# EAGLE design halo_244 (EAGLE 8.0.2)
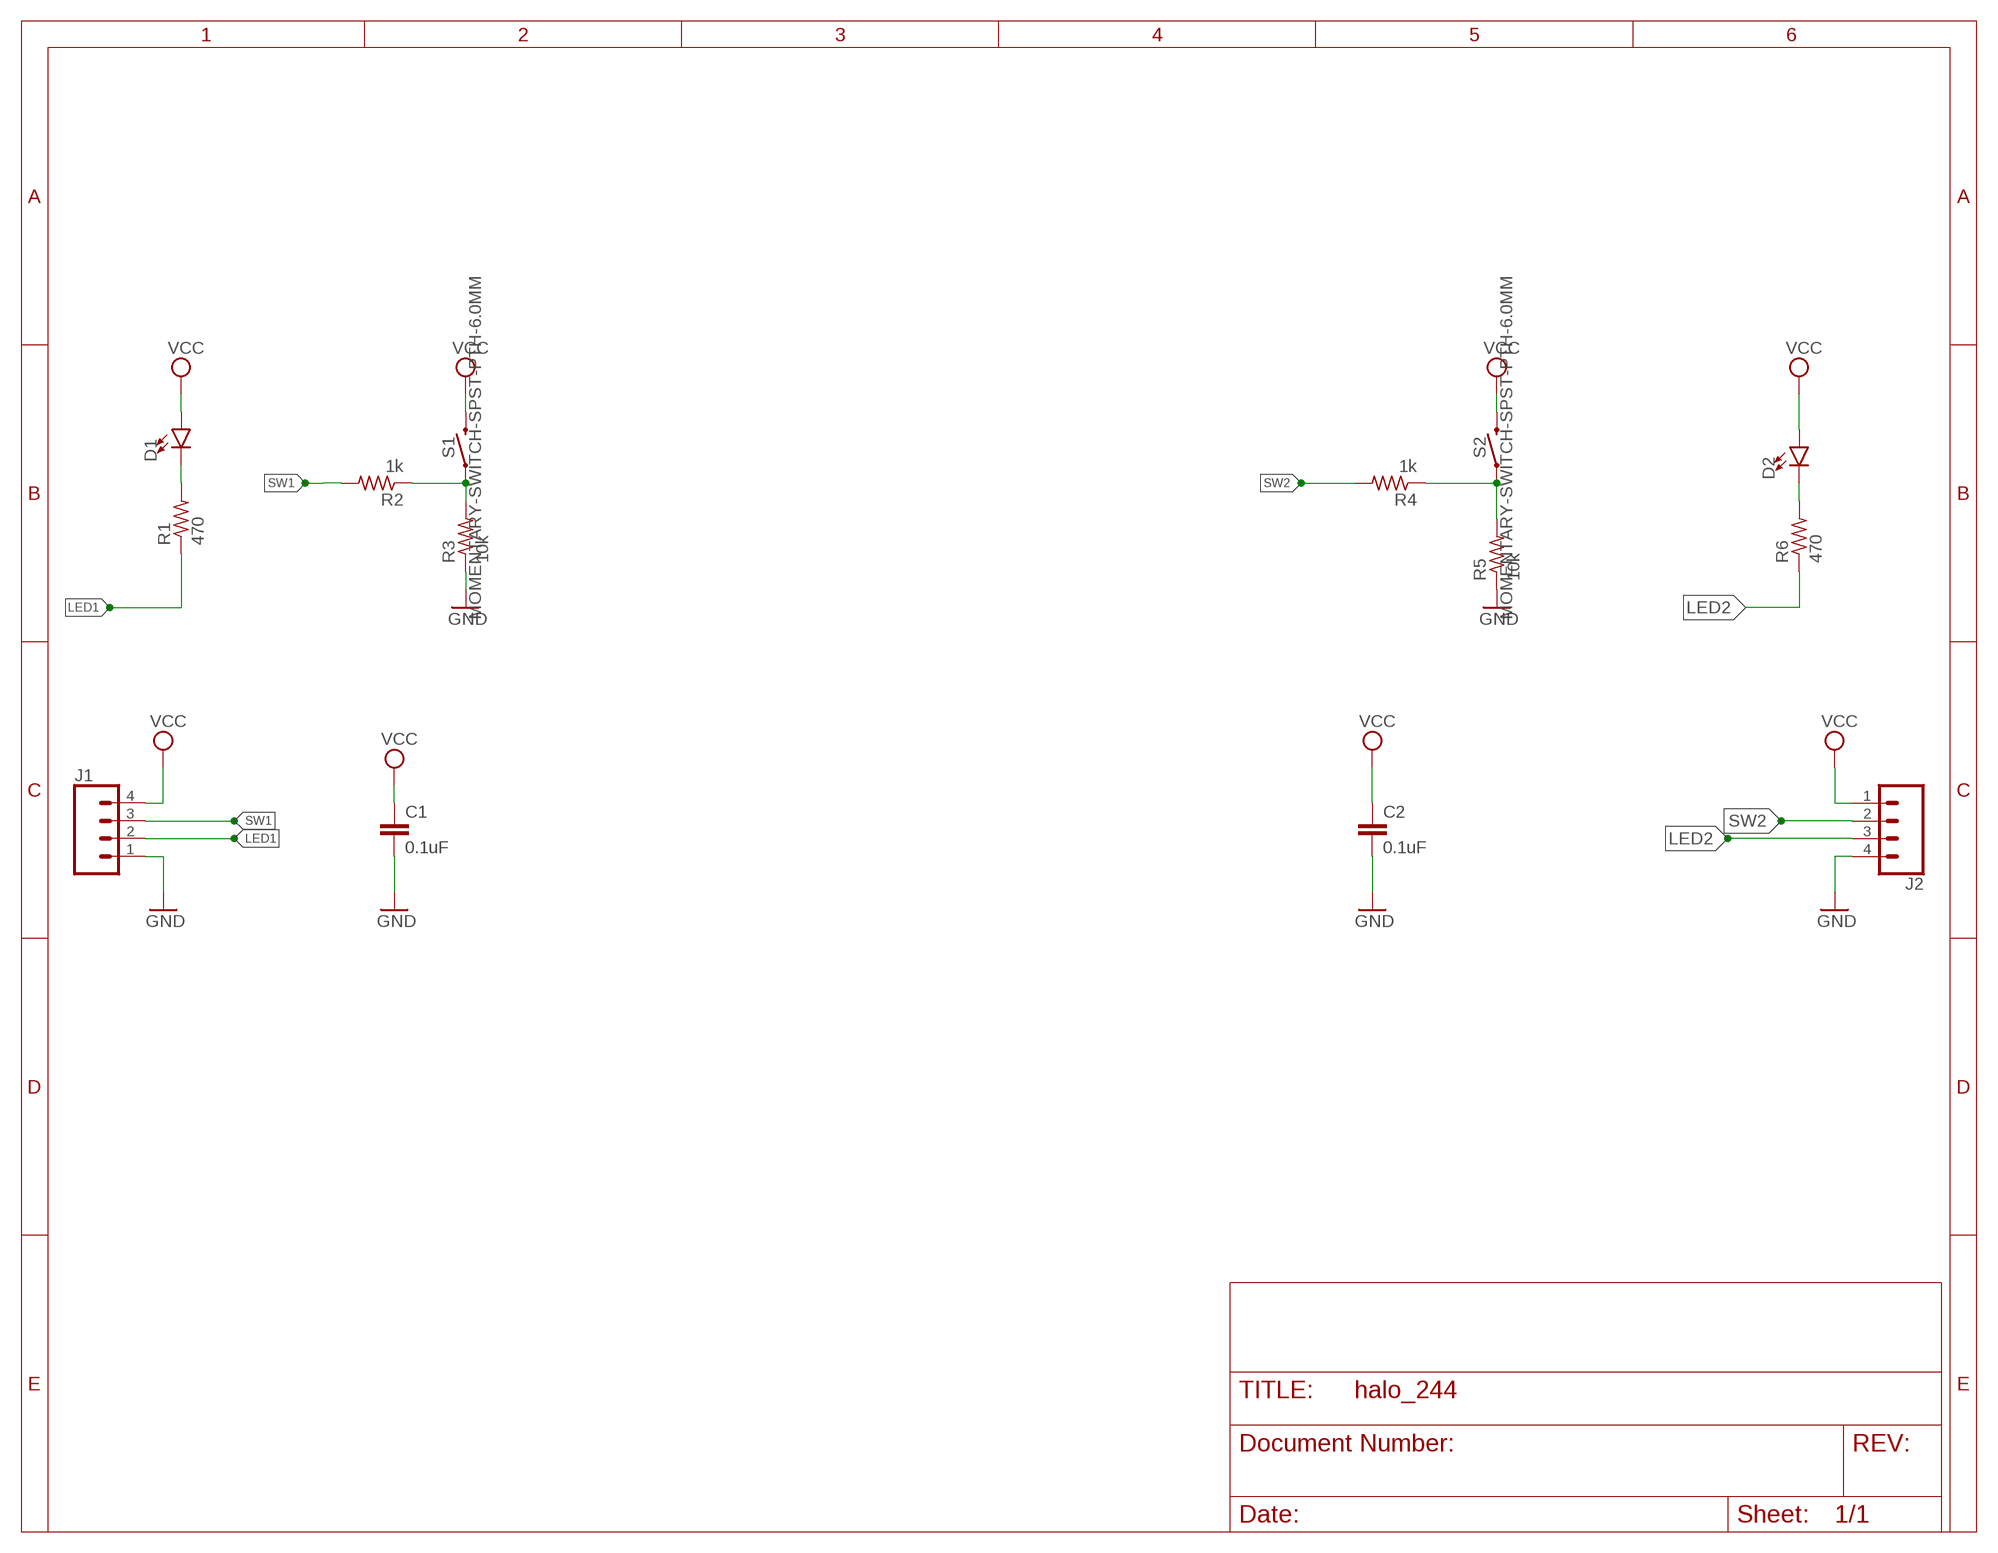
[diagram p0: schematic, sheet 1]

## Parts
C1  0.1uF  0.1UF-KIT-EZ-50V-20%  [CAP-PTH-SMALL-KIT]
C2  0.1uF  0.1UF-KIT-EZ-50V-20%  [CAP-PTH-SMALL-KIT]
D1  LED-3MM-NO_SILK  [LED_3MM-NS]
D2  LED-3MM-NO_SILK  [LED_3MM-NS]
J1  CONN_04  [1X04]
J2  CONN_04  [1X04]
R1  470  R-US_0207/12  [0207/12]
R2  1k  R-US_0207/12  [0207/12]
R3  10k  R-US_0207/12  [0207/12]
R4  1k  R-US_0207/12  [0207/12]
R5  10k  R-US_0207/12  [0207/12]
R6  470  R-US_0207/12  [0207/12]
S1  MOMENTARY-SWITCH-SPST-PTH-6.0MM  [TACTILE_SWITCH_PTH_6.0MM]
S2  MOMENTARY-SWITCH-SPST-PTH-6.0MM  [TACTILE_SWITCH_PTH_6.0MM]

## Nets
GND: C1.2 C2.2 J1.1 J2.4 R3.1 R5.1
LED1: J1.2 R1.1
LED2: J2.3 R6.1
N$1: R2.1 R3.2 S1.1
N$2: D1.K(C) R1.2
N$3: D2.K(C) R6.2
N$4: R4.1 R5.2 S2.1
SW1: J1.3 R2.2
SW2: J2.2 R4.2
VCC: C1.1 C2.1 D1.A D2.A J1.4 J2.1 S1.3 S2.3

## Library data of the parts
C1 C2 = SparkFun-Capacitors:0.1UF: 0.1µF ceramic capacitors A capacitor is a passive two-terminal electrical component used to store electrical energy temporarily in an electric field.; PROD_ID: CAP-08370
D1 D2 = SparkFun-LED:LED: LED (Generic) Standard schematic elements and footprints for 5mm, 3mm, 1206, and 0603 sized LEDs. Generic LEDs with no color specified.
J1 J2 = SparkFun-Connectors:CONN_04: Multi connection point. Often used as Generic Header-pin footprint for 0.1 inch spaced/style header connections On any of the 0.1 inch spaced packages, you can populate with these: Break Away Headers - Straight <https://www.sparkfun.com/products/116> (PRT-00116) Break Away Male Headers - Right Angle <https://www.sparkfun.com/products/553> (PRT-00553) Female Headers <https://www.sparkfun.com/products/115> (PRT-00115) Break Away Headers - Machine Pin <https://www.sparkfun.com/products/117> (PRT-00117) Break Away Female Headers - Swiss Machine Pin <https://www.sparkfun.com/products/743> (PRT-00743) For SCREWTERMINALS and SPRING TERMINALS visit here: Screw Terimnals on SparkFun.com <https://www.sparkfun.com/search/results?term=Screw+Terminals> (5mm/3.5mm/2.54mm spacing) This device is also useful as a general connection point to wire up your design to another part of your project. Our various solder wires solder well into these plated through hole pads. Hook-Up Wire - Assortment (Stranded, 22 AWG) <https://www.sparkfun.com/products/11375> (PRT-11375) Hook-Up Wire - Assortment (Solid Core, 22 AWG) <https://www.sparkfun.com/products/11367> (PRT-11367) View the entire wire category on our website here <https://www.sparkfun.com/categories/141> Special notes: Molex polarized connector foot print use with SKU : PRT-08231 with associated crimp pins and housings. 1MM SMD Version SKU: PRT-10208; OC_NEWARK: unknown; PROD_ID: CONN-09696
R1 R6 = rcl:R-US_: RESISTOR, American symbol; MF: FARNELL; MPN: MCF 0.25W 470R; OC_NEWARK: 38K0375
R2 R4 = rcl:R-US_: RESISTOR, American symbol; OC_NEWARK: unknown
R3 R5 = rcl:R-US_: RESISTOR, American symbol; MF: FARNELL; MPN: MCF 0.25W 10K; OC_NEWARK: 38K0328
S1 S2 = SparkFun-Switches:MOMENTARY-SWITCH-SPST: Momentary Switch (Pushbutton) - SPST Normally-open (NO) SPST momentary switches (buttons, pushbuttons). Variants PTH-12MM - 12mm square, through-hole Momentary Pushbutton Switch - 12mm Square <https://www.sparkfun.com/products/9190> (COM-09190) PTH-6.0MM, PTH-6.0MM-KIT - 6.0mm square, through-hole Mini Pushbutton Switch <https://www.sparkfun.com/products/97> (COM-00097) KIT package intended for soldering kit's - only one side of pads' copper is exposed. PTH-RIGHT-ANGLE-KIT - Right-angle, through-hole Right Angle Tactile Button <https://www.sparkfun.com/products/10791> - Used on SparkFun BigTime Watch Kit <https://www.sparkfun.com/products/11734> SMD-12MM - 12mm square, surface-mount Tactile Button - SMD (12mm) <https://www.sparkfun.com/products/12993> (COM-12993) Used on SparkFun PicoBoard <https://www.sparkfun.com/products/11888> SMD-4.5MM - 4.5mm Square Trackball Switch Used on SparkFun Blackberry Trackballer Breakout <https://www.sparkfun.com/products/13169> SMD-4.6MMX2.8MM - 4.60mm x 2.80mm, surface mount Used on SparkFun SAMD21 Mini Breakout <https://www.sparkfun.com/products/13664> SMD-5.2MM, SMD-5.2-REDUNDANT - 5.2mm square, surface-mount Mini Pushbutton Switch - SMD <https://www.sparkfun.com/products/8720> (COM-08720) Used on Arduino Pro Mini <https://www.sparkfun.com/products/11114> REDUNDANT package connects both switch circuits together SMD-6.0X3.5MM - 6.0 x 3.5mm, surface mount Momentary Reset Switch SMD <https://www.sparkfun.com/products/8229> (COM-08229) SMD-6.2MM-TALL - 6.2mm square, surface mount Tactile Button - SMD (6mm) <https://www.sparkfun.com/products/12992> Used on SparkFun Digital Sandbox <https://www.sparkfun.com/products/12651> SMD-RIGHT-ANGLE - Right-angle, surface mount Used on SparkFun Block for Intel® Edison - Arduino <https://www.sparkfun.com/products/13036>; PROD_ID: SWCH-08441; SF_SKU: COM-00097

## Net classes
0 default: width 0.305 mm, drill 0.508 mm, clearance 0.254 mm

## Board
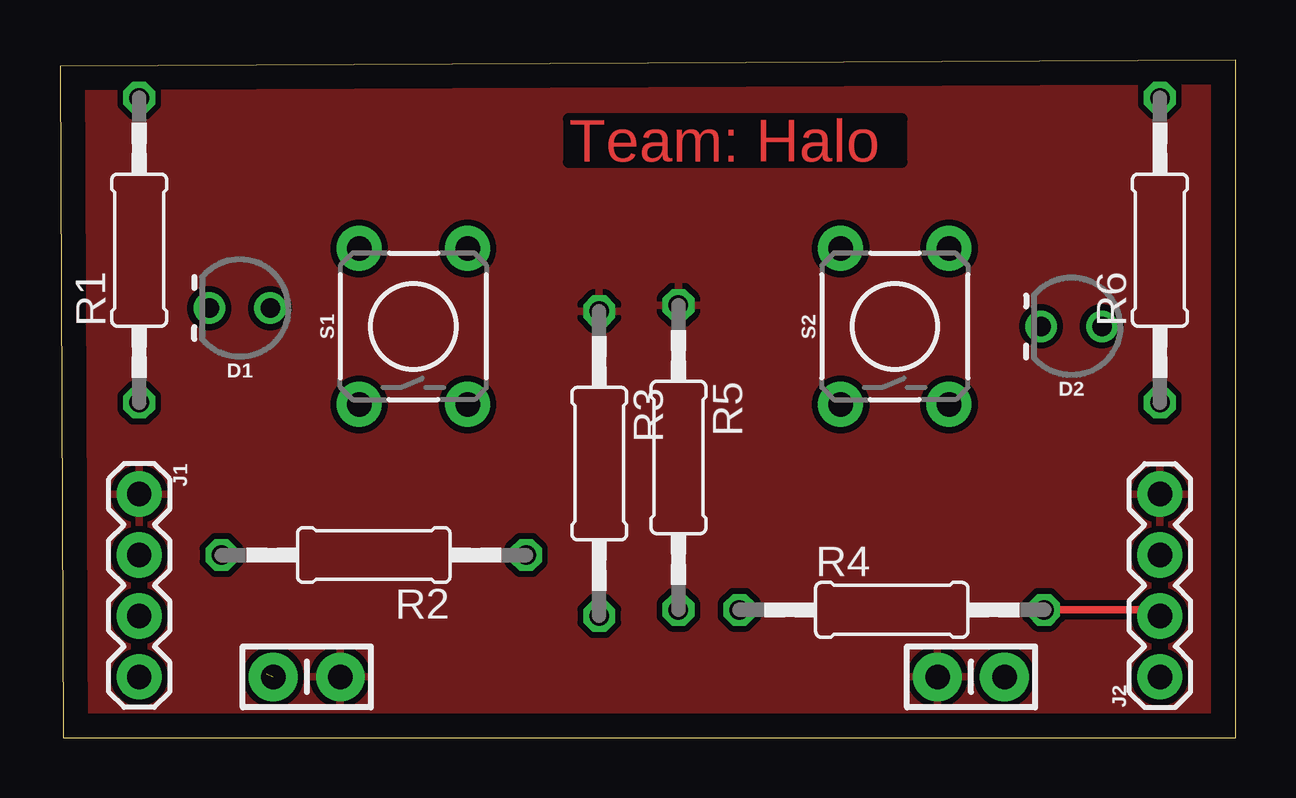
[diagram p1: board, top side]
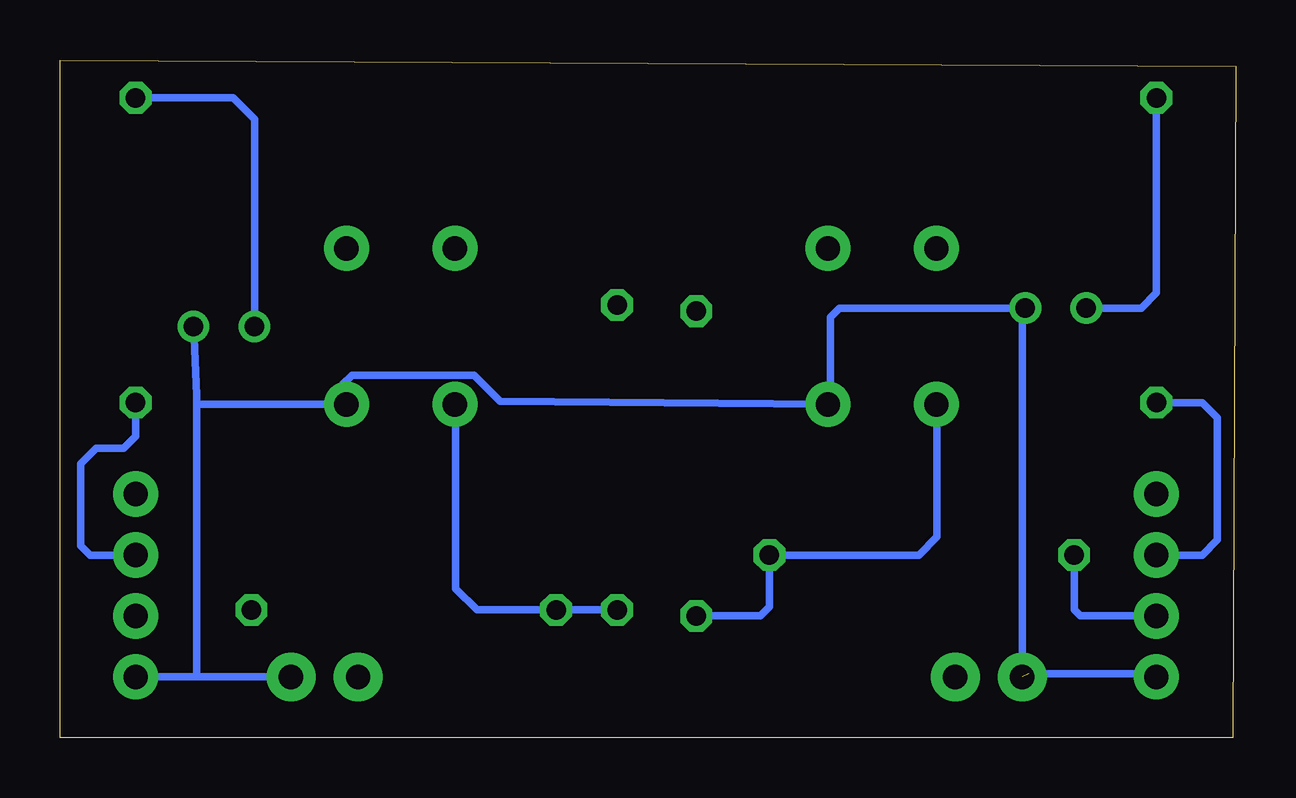
[diagram p2: board, bottom side, seen from below]

Size 49 x 28.25 mm. Coordinates in mm from the lower left corner, seen from the top.
Outline: 0.13,0 49,0 49,28.25 0,27.99 0.13,0
Copper layers (1*16): Top 0.035mm / dielectric 1.5mm / Bottom 0.035mm
Design rules "default": minimum track width 10mil, minimum drill 24mil, track to track 8mil, track to pad 8mil, pad to pad 8mil, via to via 8mil, smd to smd 8mil, copper to edge 40mil, drill to drill 8mil, minimum pad ring 10mil, minimum via ring 8mil, stop-mask expansion 4mil, vias tented up to drill 0mil, thermal gap 10mil

### Footprints (pad centres in the part's own frame; a part is rotated, then mirrored left to right if it is on the bottom)
CAP-PTH-SMALL-KIT = drill 1.016 pad 2.032: 1 -1.397,0; 2 1.397,0
LED_3MM-NS = drill 0.813: A -1.27,0; K 1.27,0
1X04 = drill 1.016 pad 1.88: 1 0,0; 2 2.54,0; 3 5.08,0; 4 7.62,0
0207/12 = drill 0.813 octagon: 1 -6.35,0; 2 6.35,0
TACTILE_SWITCH_PTH_6.0MM = drill 1.016 pad 1.88: 1 -3.251,2.261; 2 3.251,2.261; 3 -3.251,-2.261; 4 3.251,-2.261

### Placement (x,y rotation side)
C1  37.97,2.54 180 top
C2  10.29,2.54 0 top
D1  7.49,17.91 180 top
D2  42.16,17.14 180 top
J1  3.3,10.16 270 top
J2  45.85,2.54 90 top
R1  3.3,20.32 90 top
R2  13.08,7.62 180 top
R3  22.48,11.43 270 top
R4  34.67,5.33 0 top
R5  25.78,11.68 270 top
R6  45.85,20.32 90 top
S1  14.73,17.14 90 top
S2  34.8,17.14 90 top

### Tracks (layer width: path | path; a pad name or v marks a point on that pad's centre or on a via)
GND
  pour Top: 0.25,27.94 -0.13,-0.38 49.15,-0.38 49.4,28.19
LED1
  Bottom 0.305: 3.05,7.7 J1.2 1.4,7.62 0.76,8.25 0.76,13.34 1.4,13.97 R1.1
LED2
  Bottom 0.305: 46.02,7.7 J2.3 47.75,7.62 48.13,8 48.13,11.43 47.5,12.07 46.36,12.07 45.85,12.57 R6.1
N$1
  Bottom 0.305: R3.2 19.81,5.08 19.43,5.46 R2.1 13.21,7.62 12.45,8.38 12.45,13.87 S1.1
N$2
  Bottom 0.305: R1.2 3.3,18.54 3.94,17.91 D1.K
N$3
  Bottom 0.305: D2.K 40.89,25.78 41.78,26.67 R6.2
N$4
  Bottom 0.305: R5.2 R4.1 31.62,5.33 32.51,6.22 32.51,13.87 S2.1
SW1
  Bottom 0.305: R2.2 6.73,5.33 6.48,5.08 J1.3
SW2
  Top 0.305: R4.2 45.59,5.33 J2.2
VCC  (1 unrouted)
  Bottom 0.305: 45.75,2.39 J2.1 | 8.61,2.67 3.33,2.67 J1.4 | 46.02,2.67 J2.1 | 45.72,2.41 J2.1 | 43.31,2.54 J2.1 | 43.31,2.54 C1.1 | D2.A 43.31,14.28 43.31,13.97 | 43.31,13.97 43.31,2.54 | C2.1 8.89,17.65 9.14,17.91 D1.A 16.51,17.91 16.89,17.53 16.89,14 S1.3 30.66,14.02 31.75,15.11 36.83,15.11 37.21,14.73 37.21,14.05 S2.3 43.23,13.89 43.31,13.97

### Text on the board
Top: Team: Halo